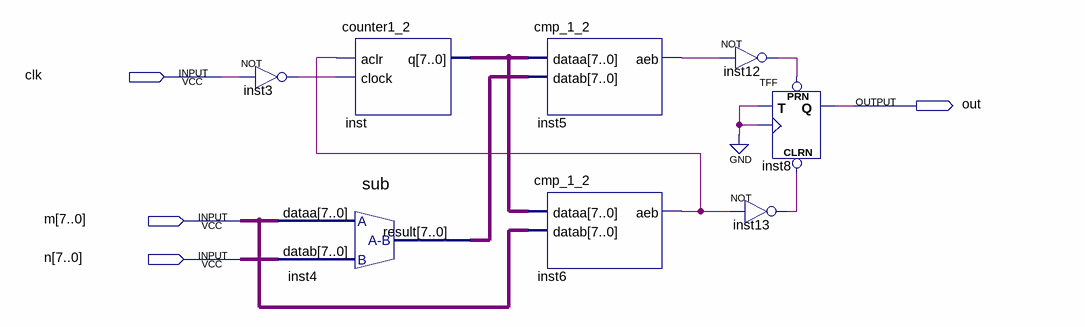
[diagram p0: schematic sheet]
// Quartus schematic Block1_additional.bdf as structural Verilog: 8 symbols, 4 pins
module Block1_additional (
  input  clk,
  input  [7:0] m,
  input  [7:0] n,
  output out
);

  wire inst3_out, inst5_aeb, inst6_aeb, inst12_out, inst13_out;
  wire [7:0] inst4_result, inst_q;

  not inst3 (inst3_out, clk);
  counter1_2 inst (.aclr(inst6_aeb), .clock(inst3_out), .q(inst_q));
  sub inst4 (.dataa(m), .datab(n), .result(inst4_result));
  cmp_1_2 inst5 (.dataa(inst_q), .datab(inst4_result), .aeb(inst5_aeb));
  cmp_1_2 inst6 (.dataa(inst_q), .datab(m), .aeb(inst6_aeb));
  not inst12 (inst12_out, inst5_aeb);
  not inst13 (inst13_out, inst6_aeb);
  TFF inst8 (.PRN(inst12_out), .CLRN(inst13_out), .T(1'b0), .CLK(1'b0), .Q(out));
endmodule
